# EAGLE design hall_test_v5 (EAGLE 7.3.0)
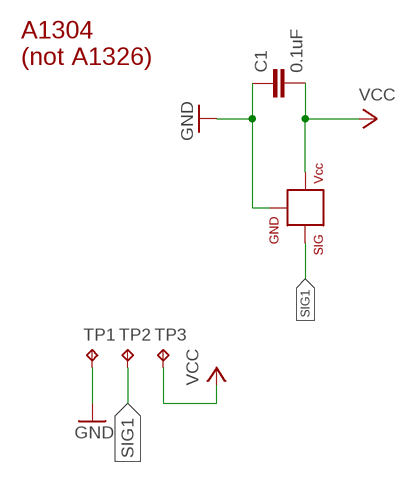
[diagram p0: schematic, sheet 1]

## Parts
C1  0.1uF  CAP0603-CAP  [0603-CAP]
HALL  HALLEFFECT-A1326  [SOT23-3]
TP1  TPTP10SQ  [TP10SQ]
TP2  TPTP10SQ  [TP10SQ]
TP3  TPTP10SQ  [TP10SQ]

## Nets
GND: C1.1 HALL.3(GND) TP1.TP
SIG1: HALL.2(SIG) TP2.TP
VCC: C1.2 HALL.1(VCC) TP3.TP

## Notes on the sheet
- A1304
  (not A1326)

## Library data of the parts
C1 = SparkFun:CAP: Capacitor Standard 0603 ceramic capacitor, and 0.1" leaded capacitor.
HALL = Andy_Sigler:HALLEFFECT-A1326
TP1-TP3 = testpad:TP: Test pad

## Board
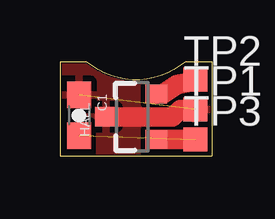
[diagram p1: board, top side]

Size 6.35 x 3.95 mm. Coordinates in mm from the lower left corner, seen from the top.
Outline: 6.35,3.95 6.35,0 0,0 0,3.95 1.1,3.95 arc82 5.25,3.95 6.35,3.95
Copper layers (1*16): Top 0.035mm / dielectric 1.5mm / Bottom 0.035mm
Design rules "default *": minimum track width 10mil, minimum drill 24mil, track to track 8mil, track to pad 8mil, pad to pad 8mil, via to via 8mil, smd to smd 8mil, copper to edge 2mil, drill to drill 8mil, minimum pad ring 10mil, minimum via ring 8mil, stop-mask expansion 4mil, vias tented up to drill 0mil, thermal gap 10mil

### Footprints (pad centres in the part's own frame; a part is rotated, then mirrored left to right if it is on the bottom)
0603-CAP = smd 1.1 x 1: 1 -0.85,0; 2 0.85,0
SOT23-3 = smd 0.8 x 0.9: 1 -0.95,-1; 2 0.95,-1; 3 0,1.1
TP10SQ = smd 1 x 1: TP 0,0

### Placement (x,y rotation side)
C1  0.8,1.7 270 top
HALL  3.02,1.64 90 top
TP1  5.65,1.95 0 top
TP2  5.65,3.2 0 top
TP3  5.65,0.7 0 top

### Tracks (layer width: path | path; a pad name or v marks a point on that pad's centre or on a via)
GND  (1 unrouted)
  Top 0.813: TP1.TP 5.03,1.95 4.7,1.64 HALL.3
  pour Top: -1,8 7,8 7,-1 -1,-1
SIG1
  Top 0.813: HALL.2 4.3,2.59 4.89,2.99 5.55,3.1 TP2.TP
VCC  (1 unrouted)
  Top 0.813: HALL.1 5.64,0.69 TP3.TP